# EAGLE design rapidshark-forward-breakout-mk-1.0 (EAGLE 7.5.0)
AUTHOR: sean@yak.net
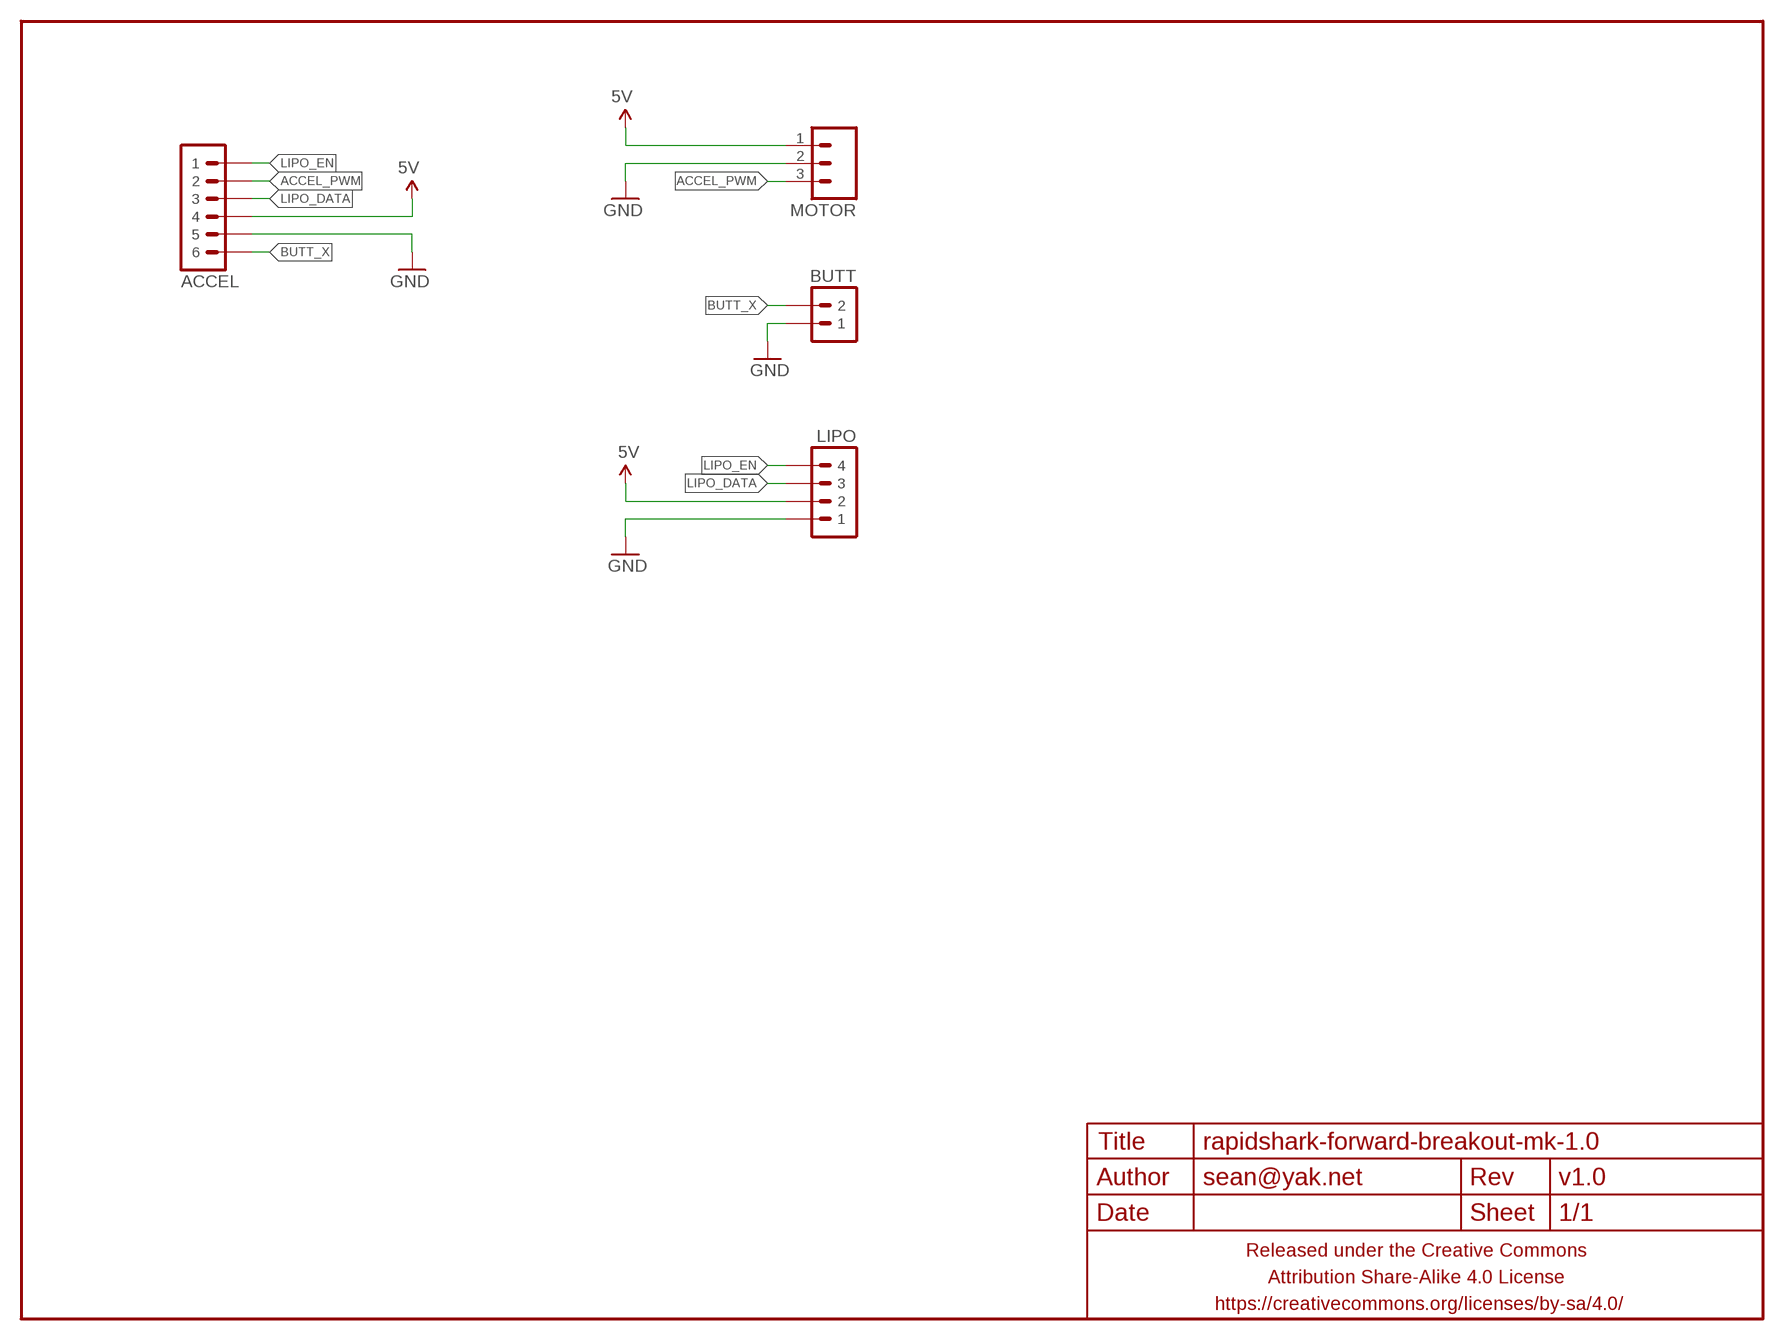
[diagram p0: schematic, sheet 1]

## Parts
ACCEL  M06JST-PH-PTH-VERT  [JST-6-PH-VERT-PTH]
BUTT  M02JST-PTH-VERT  [JST-2-PH-VERT-PTH]
FRAME1  FRAME-LETTERNO_PACKAGE  [DUMMY]
LIPO  M04JST-PTH-VERT  [JST-4-PH-VERT-PTH]
MOTOR  M03JST-PTH-VERT  [JST-3-PH-VERT-PTH]

## Nets
5V: ACCEL.4 LIPO.2 MOTOR.1
ACCEL_PWM: ACCEL.2 MOTOR.3
BUTT_X: ACCEL.6 BUTT.2
GND: ACCEL.5 BUTT.1 LIPO.1 MOTOR.2
LIPO_DATA: ACCEL.3 LIPO.3
LIPO_EN: ACCEL.1 LIPO.4

## Library data of the parts
ACCEL = a_parts:M06: Header 6 Standard 6-pin 0.1" header. Use with straight break away headers (SKU : PRT-00116), right angle break away headers (PRT-00553), swiss pins (PRT-00743), machine pins (PRT-00117), and female headers (PRT-00115). Molex polarized connector foot print use with SKU : PRT-08094 with associated crimp pins and housings. NOTES ON THE VARIANTS LOCK and LOCK_LONGPADS... This footprint was designed to help hold the alignment of a through-hole component (i.e. 6-pin header) while soldering it into place. You may notice that each hole has been shifted either up or down by 0.005 of an inch from it's more standard position (which is a perfectly straight line). This slight alteration caused the pins (the squares in the middle) to touch the edges of the holes. Because they are alternating, it causes a "brace" to hold the component in place. 0.005 has proven to be the perfect amount of "off-center" position when using our standard breakaway headers. Although looks a little odd when you look at the bare footprint, once you have a header in there, the alteration is very hard to notice. Also,if you push a header all the way into place, it is covered up entirely on the bottom side. This idea of altering the position of holes to aid alignment will be further integrated into the Sparkfun Library for other footprints. It can help hold any component with 3 or more connection pins.
BUTT = a_parts:M02: Standard 2-pin 0.1" header. Use with - straight break away headers ( PRT-00116) - right angle break away headers (PRT-00553) - swiss pins (PRT-00743) - machine pins (PRT-00117) - female headers (PRT-00115) Molex polarized connector foot print use with: PRT-08233 with associated crimp pins and housings. 2.54_SCREWTERM for use with PRT-10571. 3.5mm Screw Terminal footprints for PRT-08084 5mm Screw Terminal footprints for use with PRT-08433
FRAME1 = a_parts:FRAME-LETTER: Schematic Frame Standard 8.5x11 US Letter frame; DESIGNER: sean@yak.net; VERSION: v1.0
LIPO = a_parts:M04: Header 4 Standard 4-pin 0.1" header. Use with straight break away headers (SKU : PRT-00116), right angle break away headers (PRT-00553), swiss pins (PRT-00743), machine pins (PRT-00117), and female headers (PRT-00115). Molex polarized connector foot print use with SKU : PRT-08231 with associated crimp pins and housings. 1MM SMD Version SKU: PRT-10208
MOTOR = a_parts:M03: Header 3 Standard 3-pin 0.1" header. Use with straight break away headers (SKU : PRT-00116), right angle break away headers (PRT-00553), swiss pins (PRT-00743), machine pins (PRT-00117), and female headers (PRT-00115). Molex polarized connector foot print use with SKU : PRT-08232 with associated crimp pins and housings.

## Board
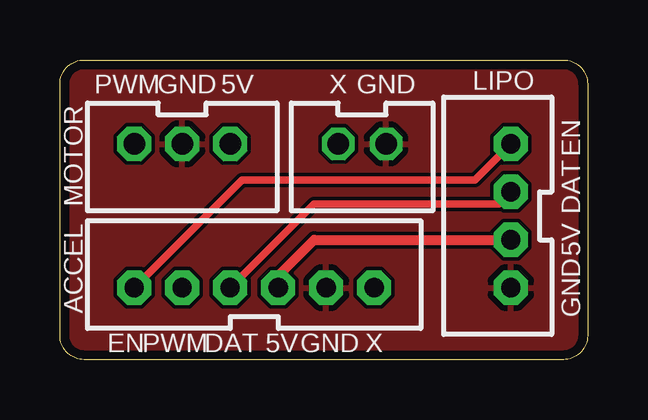
[diagram p1: board, top side]
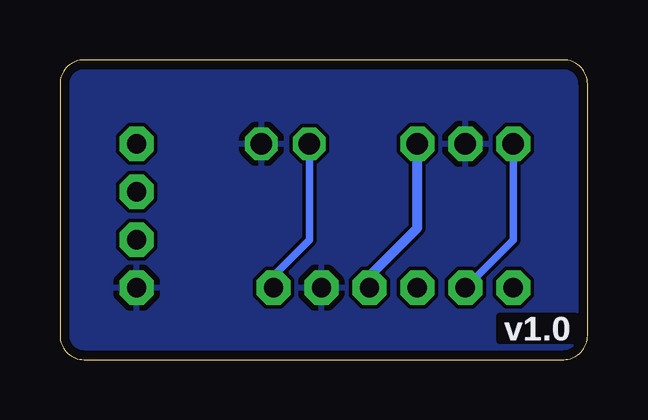
[diagram p2: board, bottom side, seen from below]

Size 22 x 12.5 mm. Coordinates in mm from the lower left corner, seen from the top.
Outline: 0,1 0,11.5 arc-90 1,12.5 21,12.5 arc-90 22,11.5 22,1 arc-90 21,0 1,0 arc-90 0,1
Copper layers (1*16): Top 0.0356mm / dielectric 1.5011mm / Bottom 0.0356mm
Design rules "LaenPCBOrder_2": minimum track width 6mil, minimum drill 13mil, track to track 6mil, track to pad 6mil, pad to pad 6mil, via to via 6mil, smd to smd 6mil, copper to edge 15mil, drill to drill 6mil, minimum pad ring 7mil, minimum via ring 7mil, stop-mask expansion 3mil, vias tented up to drill 20mil, thermal gap 10mil

### Footprints (pad centres in the part's own frame; a part is rotated, then mirrored left to right if it is on the bottom)
JST-6-PH-VERT-PTH = drill 0.8 pad 1.422 octagon: 1 -5,0; 2 -3,0; 3 -1,0; 4 1,0; 5 3,0; 6 5,0
JST-2-PH-VERT-PTH = drill 0.9 octagon: 1 -1,0; 2 1,0
JST-4-PH-VERT-PTH = drill 0.8 pad 1.422 octagon: 1 0,0; 2 2,0; 3 4,0; 4 6,0
JST-3-PH-VERT-PTH = drill 0.9 pad 1.422 octagon: 1 0,0; 2 2,0; 3 4,0

### Placement (x,y rotation side)
ACCEL  8.1,3 0 top
BUTT  12.6,9 180 top
FRAME1  0,0 270 bottom
LIPO  18.8,3 90 top
MOTOR  7.1,9 180 top

### Tracks (layer width: path | path; a pad name or v marks a point on that pad's centre or on a via)
5V
  Top 0.406: ACCEL.4 9.1,3.5 10.6,5 LIPO.2
  Bottom 0.406: ACCEL.4 9.1,3.5 7.1,5.5 MOTOR.1
ACCEL_PWM
  Bottom 0.305: ACCEL.2 3.1,5 MOTOR.3
BUTT_X
  Bottom 0.305: ACCEL.6 13.1,3.5 11.6,5 BUTT.2
GND
  pour Top (rank 6): 0,1 0,11.5 arc-90 1,12.5 21,12.5 arc-90 22,11.5 22,1 arc-90 21,0 1,0 arc-90
  pour Bottom (rank 6): 0,1 0,11.5 arc-90 1,12.5 21,12.5 arc-90 22,11.5 22,1 arc-90 21,0 1,0 arc-90
LIPO_DATA
  Top 0.305: ACCEL.3 10.6,6.5 18.3,6.5 LIPO.3
LIPO_EN
  Top 0.305: ACCEL.1 7.6,7.5 17.3,7.5 LIPO.4

### Text on the board
tPlace: PWM | GND | 5V | X | GND | EN | DAT | 5V | GND | EN | PWM | DAT | 5V | GND | X